# EAGLE design comms_v2 (EAGLE 9.6.2)
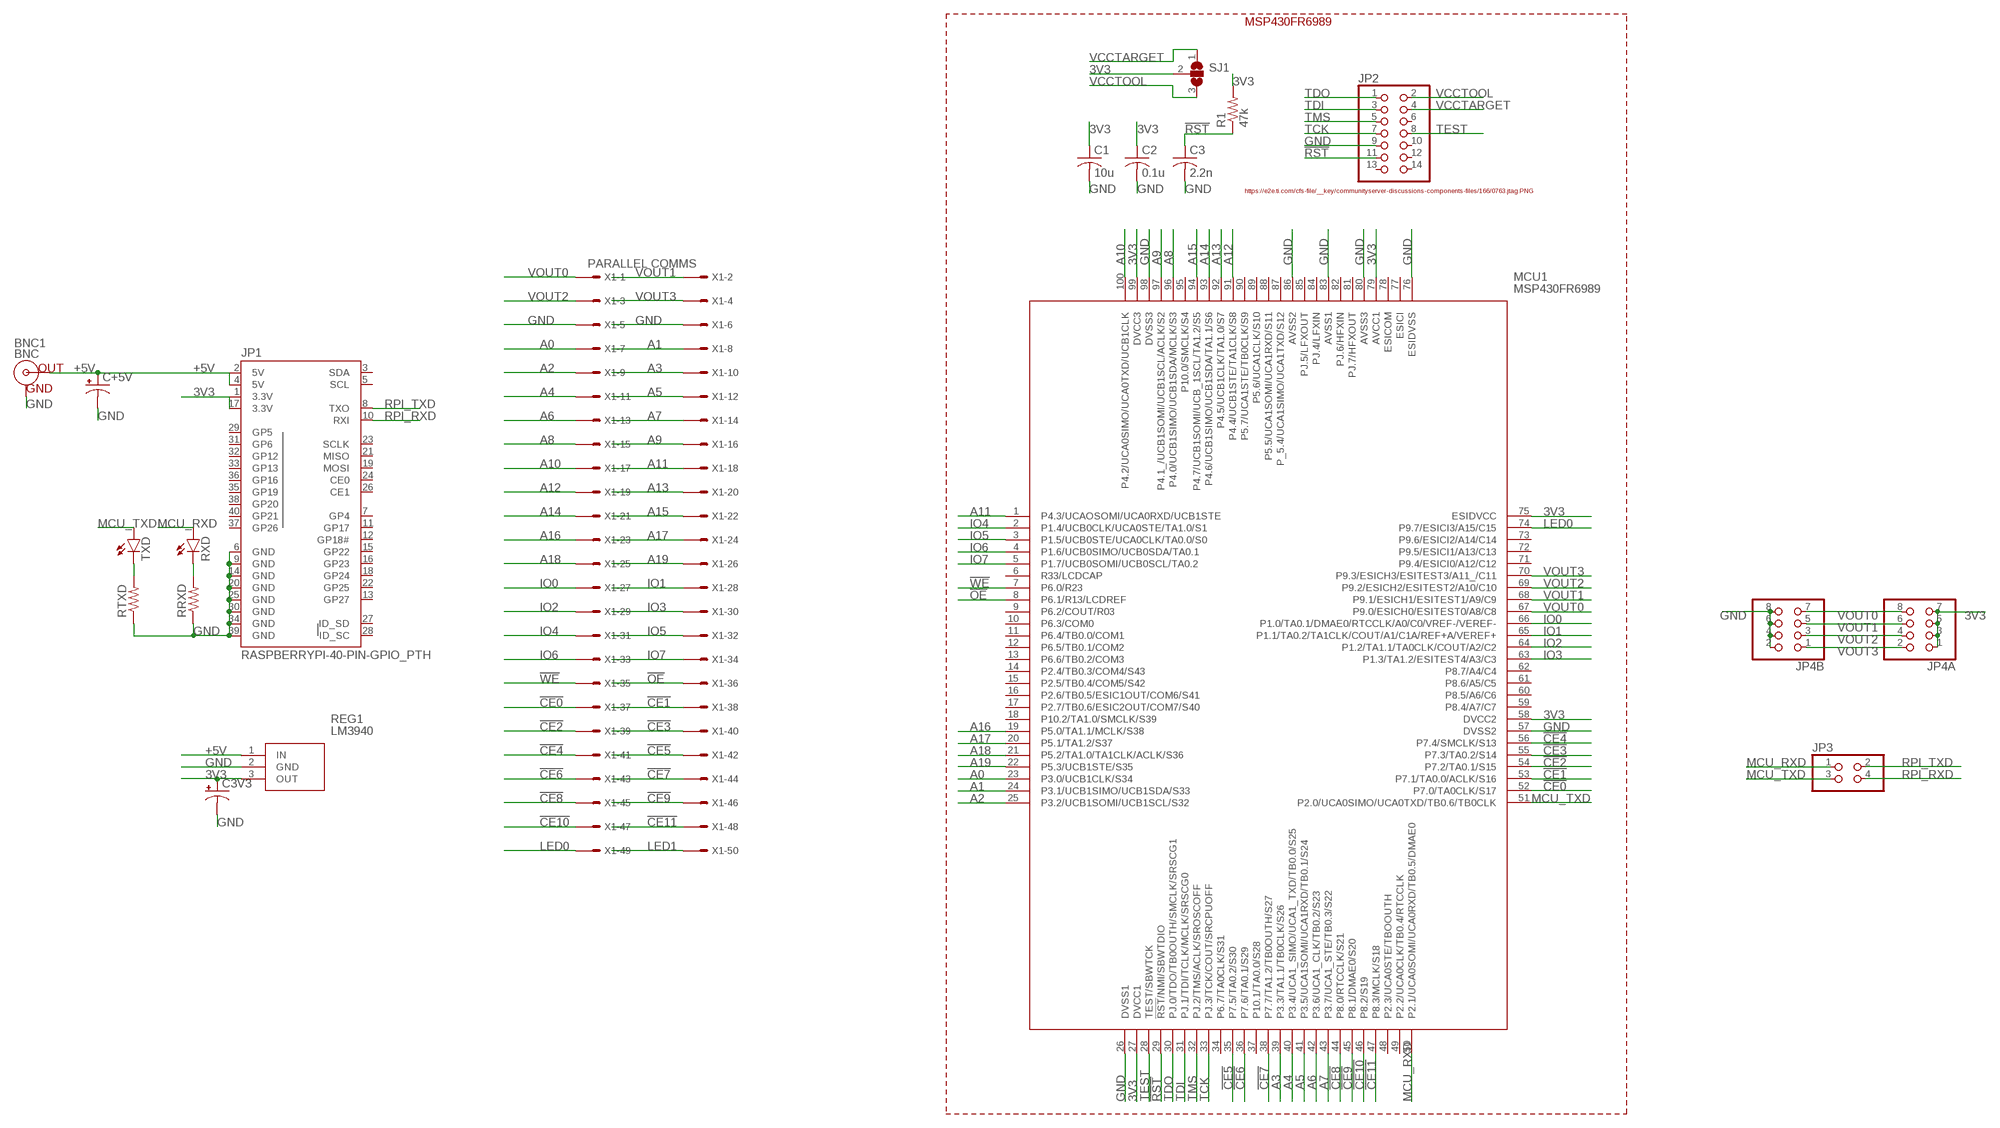
[diagram p0: schematic, sheet 1]

## Parts
BNC1  BNC  BNCPTH  [BNC]
C1  10u  C-USC0805  [C0805]
C2  0.1u  C-USC0805  [C0805]
C3  2.2n  C-USC0805  [C0805]
C3V3  CPOL-USE2.5-6  [E2,5-6]
C+5V  CPOL-USE2.5-6  [E2,5-6]
JP1  RASPBERRYPI-40-PIN-GPIO_PTH  [2X20_SHROUDED]
JP2  PINHD-2X7  [2X07]
JP3  PINHD-2X2  [2X02]
JP4A  PINHD-2X4  [2X04]
JP4B  PINHD-2X4  [2X04]
MCU1  MSP430FR6989  MSP430FR6989IPZR  [QFP50P1600X1600X160-100N]
R1  47k  R-US_R0805  [R0805]
REG1  LM3940  LM3940IT-3.3_NOPB  [TO254P470X1028X1955-3P]
RRXD  R-US_0204/7  [0204/7]
RTXD  R-US_0204/7  [0204/7]
RXD  LED3MM  [LED3MM]
SJ1  SJ2W  [SJ_2]
TXD  LED3MM  [LED3MM]
X1  PARALLEL COMMS  057-050-1  [057-050-1]

## Nets
3V3: C1.1 C2.1 C3V3.+ JP1.1(3.3V) JP1.17(3.3V) JP4A.1 JP4A.3 JP4A.5 JP4A.7 MCU1.27(DVCC1) MCU1.58(DVCC2) MCU1.75(ESIDVCC) MCU1.79(AVCC1) MCU1.99(DVCC3) R1.2 REG1.3(OUT) SJ1.2
!CE0: MCU1.52(P7.0/TA0CLK/S17) X1.37
!CE1: MCU1.53(P7.1/TA0.0/ACLK/S16) X1.38
!CE2: MCU1.54(P7.2/TA0.1/S15) X1.39
!CE3: MCU1.55(P7.3/TA0.2/S14) X1.40
!CE4: MCU1.56(P7.4/SMCLK/S13) X1.41
!CE5: MCU1.35(P7.5/TA0.2/S30) X1.42
!CE6: MCU1.36(P7.6/TA0.1/S29) X1.43
!CE7: MCU1.38(P7.7/TA1.2/TB0OUTH/S27) X1.44
!CE8: MCU1.44(P8.0/RTCCLK/S21) X1.45
!CE9: MCU1.45(P8.1/DMAE0/S20) X1.46
!CE10: MCU1.46(P8.2/S19) X1.47
!CE11: MCU1.47(P8.3/MCLK/S18) X1.48
!OE: MCU1.8(P6.1/R13/LCDREF) X1.36
!RST: C3.1 JP2.11 MCU1.29(!RST!/NMI/SBWTDIO) R1.1
!WE: MCU1.7(P6.0/R23) X1.35
+5V: BNC1.S(OUT) C+5V.+ JP1.2(5V) JP1.4(5V) REG1.1(IN)
A0: MCU1.23(P3.0/UCB1CLK/S34) X1.7
A1: MCU1.24(P3.1/UCB1SIMO/UCB1SDA/S33) X1.8
A2: MCU1.25(P3.2/UCB1SOMI/UCB1SCL/S32) X1.9
A3: MCU1.39(P3.3/TA1.1/TB0CLK/S26) X1.10
A4: MCU1.40(P3.4/UCA1_SIMO/UCA1_TXD/TB0.0/S25) X1.11
A5: MCU1.41(P3.5/UCA1SOMI/UCA1RXD/TB0.1/S24) X1.12
A6: MCU1.42(P3.6/UCA1_CLK/TB0.2/S23) X1.13
A7: MCU1.43(P3.7/UCA1_STE/TB0.3/S22) X1.14
A8: MCU1.96(P4.0/UCB1SIMO/UCB1SDA/MCLK/S3) X1.15
A9: MCU1.97(P4.1_/UCB1SOMI/UCB1SCL/ACLK/S2) X1.16
A10: MCU1.100(P4.2/UCA0SIMO/UCA0TXD/UCB1CLK) X1.17
A11: MCU1.1(P4.3/UCAOSOMI/UCA0RXD/UCB1STE) X1.18
A12: MCU1.91(P4.4/UCB1STE/TA1CLK/S8) X1.19
A13: MCU1.92(P4.5/UCB1CLK/TA1.0/S7) X1.20
A14: MCU1.93(P4.6/UCB1SIMO/UCB1SDA/TA1.1/S6) X1.21
A15: MCU1.94(P4.7/UCB1SOMI/UCB_1SCL/TA1.2/S5) X1.22
A16: MCU1.19(P5.0/TA1.1/MCLK/S38) X1.23
A17: MCU1.20(P5.1/TA1.2/S37) X1.24
A18: MCU1.21(P5.2/TA1.0/TA1CLK/ACLK/S36) X1.25
A19: MCU1.22(P5.3/UCB1STE/S35) X1.26
GND: BNC1.GND C1.2 C2.2 C3.2 C3V3.- C+5V.- JP1.6(GND) JP1.9(GND) JP1.14(GND) JP1.20(GND) JP1.25(GND) JP1.30(GND) JP1.34(GND) JP1.39(GND) JP2.9 JP4B.2 JP4B.4 JP4B.6 JP4B.8 MCU1.26(DVSS1) MCU1.57(DVSS2) MCU1.76(ESIDVSS) MCU1.80(AVSS3) MCU1.83(AVSS1) MCU1.86(AVSS2) MCU1.98(DVSS3) REG1.2(GND) RRXD.1 RTXD.1 X1.5 X1.6
IO0: MCU1.66(P1.0/TA0.1/DMAE0/RTCCLK/A0/C0/VREF-/VEREF-) X1.27
IO1: MCU1.65(P1.1/TA0.2/TA1CLK/COUT/A1/C1A/REF+A/VEREF+) X1.28
IO2: MCU1.64(P1.2/TA1.1/TA0CLK/COUT/A2/C2) X1.29
IO3: MCU1.63(P1.3/TA1.2/ESITEST4/A3/C3) X1.30
IO4: MCU1.2(P1.4/UCB0CLK/UCA0STE/TA1.0/S1) X1.31
IO5: MCU1.3(P1.5/UCB0STE/UCA0CLK/TA0.0/S0) X1.32
IO6: MCU1.4(P1.6/UCB0SIMO/UCB0SDA/TA0.1) X1.33
IO7: MCU1.5(P1.7/UCB0SOMI/UCB0SCL/TA0.2) X1.34
LED0: MCU1.74(P9.7/ESICI3/A15/C15) X1.49
LED1: X1.50
MCU_RXD: JP3.1 MCU1.50(P2.1/UCA0SOMI/UCA0RXD/TB0.5/DMAE0) RXD.A
MCU_TXD: JP3.3 MCU1.51(P2.0/UCA0SIMO/UCA0TXD/TB0.6/TB0CLK) TXD.A
N$1: RTXD.2 TXD.K(C)
N$2: RRXD.2 RXD.K(C)
RPI_RXD: JP1.10(RXI) JP3.4
RPI_TXD: JP1.8(TXO) JP3.2
TCK: JP2.7 MCU1.33(PJ.3/TCK/COUT/SRCPUOFF)
TDI: JP2.3 MCU1.31(PJ.1/TDI/TCLK/MCLK/SRSCG0)
TDO: JP2.1 MCU1.30(PJ.0/TDO/TB0OUTH/SMCLK/SRSCG1)
TEST: JP2.8 MCU1.28(TEST/SBWTCK)
TMS: JP2.5 MCU1.32(PJ.2/TMS/ACLK/SROSCOFF)
VCCTARGET: JP2.4 SJ1.1
VCCTOOL: JP2.2 SJ1.3
VOUT0: JP4A.8 JP4B.7 MCU1.67(P9.0/ESICH0/ESITEST0/A8/C8) X1.1
VOUT1: JP4A.6 JP4B.5 MCU1.68(P9.1/ESICH1/ESITEST1/A9/C9) X1.2
VOUT2: JP4A.4 JP4B.3 MCU1.69(P9.2/ESICH2/ESITEST2/A10/C10) X1.3
VOUT3: JP4A.2 JP4B.1 MCU1.70(P9.3/ESICH3/ESITEST3/A11_/C11) X1.4
Unconnected: JP1.3(SDA) JP1.5(SCL) JP1.7(GP4) JP1.11(GP17) JP1.12(GP18#) JP1.13(GP27) JP1.15(GP22) JP1.16(GP23) JP1.18(GP24) JP1.19(MOSI) JP1.21(MISO) JP1.22(GP25) JP1.23(SCLK) JP1.24(CE0) JP1.26(CE1) JP1.27(ID_SD) JP1.28(ID_SC) JP1.29(GP5) JP1.31(GP6) JP1.32(GP12) JP1.33(GP13) JP1.35(GP19) JP1.36(GP16) JP1.37(GP26) JP1.38(GP20) JP1.40(GP21) JP2.6 JP2.10 JP2.12 JP2.13 JP2.14 MCU1.6(R33/LCDCAP) MCU1.9(P6.2/COUT/R03) MCU1.10(P6.3/COM0) MCU1.11(P6.4/TB0.0/COM1) MCU1.12(P6.5/TB0.1/COM2) MCU1.13(P6.6/TB0.2/COM3) MCU1.14(P2.4/TB0.3/COM4/S43) MCU1.15(P2.5/TB0.4/COM5/S42) MCU1.16(P2.6/TB0.5/ESIC1OUT/COM6/S41) MCU1.17(P2.7/TB0.6/ESIC2OUT/COM7/S40) MCU1.18(P10.2/TA1.0/SMCLK/S39) MCU1.34(P6.7/TA0CLK/S31) MCU1.37(P10.1/TA0.0/S28) MCU1.48(P2.3/UCA0STE/TBOOUTH) MCU1.49(P2.2/UCA0CLK/TB0.4/RTCCLK) MCU1.59(P8.4/A7/C7) MCU1.60(P8.5/A6/C6) MCU1.61(P8.6/A5/C5) MCU1.62(P8.7/A4/C4) MCU1.71(P9.4/ESICI0/A12/C12) MCU1.72(P9.5/ESICI1/A13/C13) MCU1.73(P9.6/ESICI2/A14/C14) MCU1.77(ESICI) MCU1.78(ESICOM) MCU1.81(PJ.7/HFXOUT) MCU1.82(PJ.6/HFXIN) MCU1.84(PJ.4/LFXIN) MCU1.85(PJ.5/LFXOUT) MCU1.87(P_5.4/UCA1SIMO/UCA1TXD/S12) MCU1.88(P5.5/UCA1SOMI/UCA1RXD/S11) MCU1.89(P5.6/UCA1CLK/S10) MCU1.90(P5.7/UCA1STE/TB0CLK/S9) MCU1.95(P10.0/SMCLK/S4)

## Notes on the sheet
- MSP430FR6989
- https://e2e.ti.com/cfs-file/__key/communityserver-discussions-components-files/166/0763.jtag.PNG

## Library data of the parts
BNC1 = SparkFun-Connectors:BNC: BNC Right Angle Connector Mouser Part# 5227161 SparkFun Products: BNC Connector - Right Angle <https://www.sparkfun.com/products/10550>; PROD_ID: LPA-12729; SF_ID: PRT-10550
C1-C3 = rcl:C-US: CAPACITOR, American symbol; SPICEPREFIX: C
C3V3 C+5V = rcl:CPOL-US: POLARIZED CAPACITOR, American symbol; SPICEPREFIX: C
JP1 = SparkFun-Connectors:RASPBERRYPI-40-PIN-GPIO: Raspberry Pi GPIO Header 2x20 pin connector, as found on B, B+, A+ models. Both shrouded PTH and SMT versions available. SparkFun Products: GPIO Shrouded Header <https://www.sparkfun.com/products/13054>- PTH SparkFun Pi Wedge (Preassembled) <https://www.sparkfun.com/products/13717>; PROD_ID: CONN-12263; SF_ID: PRT-13054
JP2 = pinhead:PINHD-2X7: PIN HEADER
JP3 = pinhead:PINHD-2X2: PIN HEADER
JP4A JP4B = pinhead:PINHD-2X4: PIN HEADER
MCU1 = SamacSys_Parts:MSP430FR6989IPZR: MSP430FR6989 16 MHz ULP Microcontroller - 128 KB FRAM, 2KB SRAM, 83 IO, ADC12, LCD, AES, Scan IF Source: Datasheet <http://www.ti.com/lit/gpn/msp430fr6989>; ARROW_PART_NUMBER: MSP430FR6989IPZR; ARROW_PRICE-STOCK: https://www.arrow.com/en/products/msp430fr6989ipzr/texas-instruments?region=nac; DESCRIPTION: MSP430FR6989 16 MHz ULP Microcontroller - 128 KB FRAM, 2KB SRAM, 83 IO, ADC12, LCD, AES, Scan IF; HEIGHT: 1.6mm; MANUFACTURER_NAME: Texas Instruments; MANUFACTURER_PART_NUMBER: MSP430FR6989IPZR; MOUSER_PART_NUMBER: 595-MSP430FR6989IPZR; MOUSER_PRICE-STOCK: https://www.mouser.co.uk/ProductDetail/Texas-Instruments/MSP430FR6989IPZR?qs=m1T3c8F5IULmogipCvLVbA%3D%3D
R1 RRXD RTXD = rcl:R-US_: RESISTOR, American symbol; SPICEPREFIX: R
REG1 = SamacSys_Parts:LM3940IT-3.3_NOPB: 1A,3.3V,LDO Voltage Reg.,LM3940IT-3.3 Texas Instruments LM3940IT-3.3/NOPB, LDO Voltage Regulator, 1A, 3.3 V, 4.5 7.5 Vin, 3-Pin TO-220 Source: Datasheet <http://www.ti.com/general/docs/lit/getliterature.tsp?genericPartNumber=LM3940&&fileType=pdf>; ARROW_PART_NUMBER: LM3940IT-3.3/NOPB; ARROW_PRICE-STOCK: https://www.arrow.com/en/products/lm3940it-3.3nopb/texas-instruments?region=nac; DESCRIPTION: 1A,3.3V,LDO Voltage Reg.,LM3940IT-3.3 Texas Instruments LM3940IT-3.3/NOPB, LDO Voltage Regulator, 1A, 3.3 V, 4.5 7.5 Vin, 3-Pin TO-220; HEIGHT: 4.7mm; MANUFACTURER_NAME: Texas Instruments; MANUFACTURER_PART_NUMBER: LM3940IT-3.3/NOPB; MOUSER_PART_NUMBER: 926-LM3940IT-3.3NOPB; MOUSER_PRICE-STOCK: https://www.mouser.co.uk/ProductDetail/Texas-Instruments/LM3940IT-33-NOPB?qs=QbsRYf82W3FGrjqcSAbcdA%3D%3D
RXD TXD = led:LED: LED OSRAM: - CHIPLED LG R971, LG N971, LY N971, LG Q971, LY Q971, LO R971, LY R971 LH N974, LH R974 LS Q976, LO Q976, LY Q976 LO Q996 - Hyper CHIPLED LW Q18S LB Q993, LB Q99A, LB R99A - SideLED LS A670, LO A670, LY A670, LG A670, LP A670 LB A673, LV A673, LT A673, LW A673 LH A674 LY A675 LS A676, LA A676, LO A676, LY A676, LW A676 LS A679, LY A679, LG A679 - Hyper Micro SIDELED® LS Y876, LA Y876, LO Y876, LY Y876 LT Y87S - SmartLED LW L88C, LW L88S LB L89C, LB L89S, LG L890 LS L89K, LO L89K, LY L89K LS L896, LA L896, LO L896, LY L896 - TOPLED LS T670, LO T670, LY T670, LG T670, LP T670 LSG T670, LSP T670, LSY T670, LOP T670, LYG T670 LG T671, LOG T671, LSG T671 LB T673, LV T673, LT T673, LW T673 LH T674 LS T676, LA T676, LO T676, LY T676, LB T676, LH T676, LSB T676, LW T676 LB T67C, LV T67C, LT T67C, LS T67K, LO T67K, LY T67K, LW E67C LS E67B, LA E67B, LO E67B, LY E67B, LB E67C, LV E67C, LT E67C LW T67C LS T679, LY T679, LG T679 LS T770, LO T770, LY T770, LG T770, LP T770 LB T773, LV T773, LT T773, LW T773 LH T774 LS E675, LA E675, LY E675, LS T675 LS T776, LA T776, LO T776, LY T776, LB T776 LHGB T686 LT T68C, LB T68C - Hyper Mini TOPLED® LB M676 - Mini TOPLED Santana® LG M470 LS M47K, LO M47K, LY M47K Source: http://www.osram.convergy.de LUXEON: - LUMILED® LXK2-PW12-R00, LXK2-PW12-S00, LXK2-PW14-U00, LXK2-PW14-V00 LXK2-PM12-R00, LXK2-PM12-S00, LXK2-PM14-U00 LXK2-PE12-Q00, LXK2-PE12-R00, LXK2-PE12-S00, LXK2-PE14-T00, LXK2-PE14-U00 LXK2-PB12-K00, LXK2-PB12-L00, LXK2-PB12-M00, LXK2-PB14-N00, LXK2-PB14-P00, LXK2-PB14-Q00 LXK2-PR12-L00, LXK2-PR12-M00, LXK2-PR14-Q00, LXK2-PR14-R00 LXK2-PD12-Q00, LXK2-PD12-R00, LXK2-PD12-S00 LXK2-PH12-R00, LXK2-PH12-S00 LXK2-PL12-P00, LXK2-PL12-Q00, LXK2-PL12-R00 Source: www.luxeon.com KINGBRIGHT: KA-3528ASYC Source: www.kingbright.com
SJ1 = jumper:SJ2W: SMD solder JUMPER
X1 = con-panduit:057-050-: CONNECTOR 50-pin series 057 contact pc board low profile headers; OC_FARNELL: unknown; OC_NEWARK: unknown

## Net classes
2 lowpower: width 0.305 mm, drill 0.483 mm

## Board
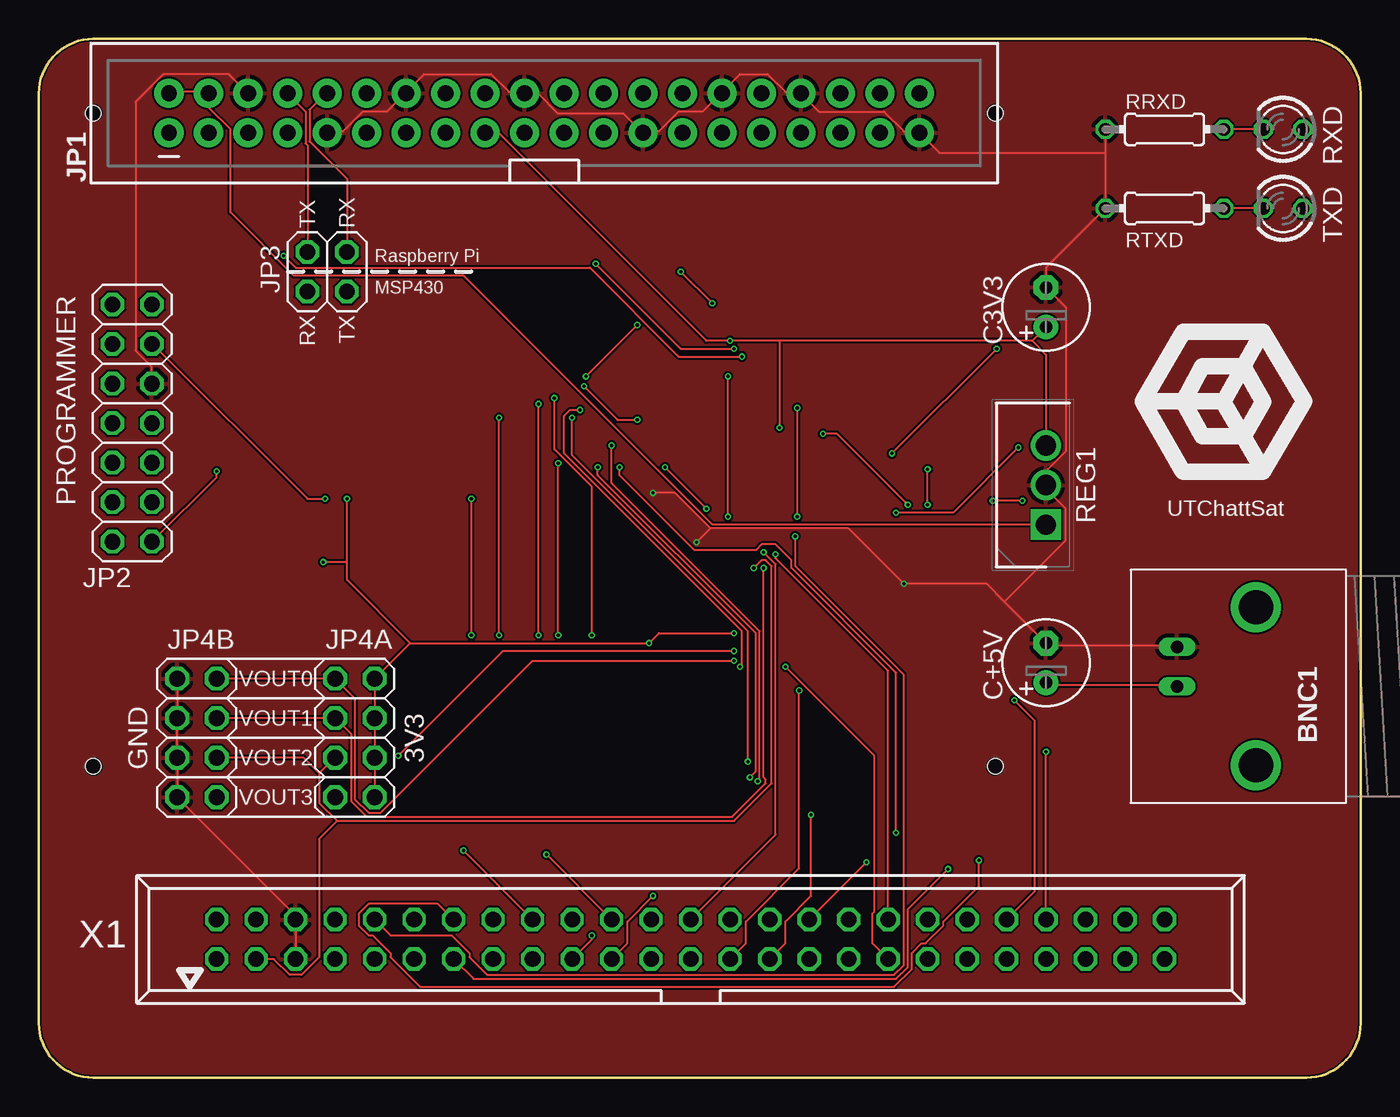
[diagram p1: board, top side]
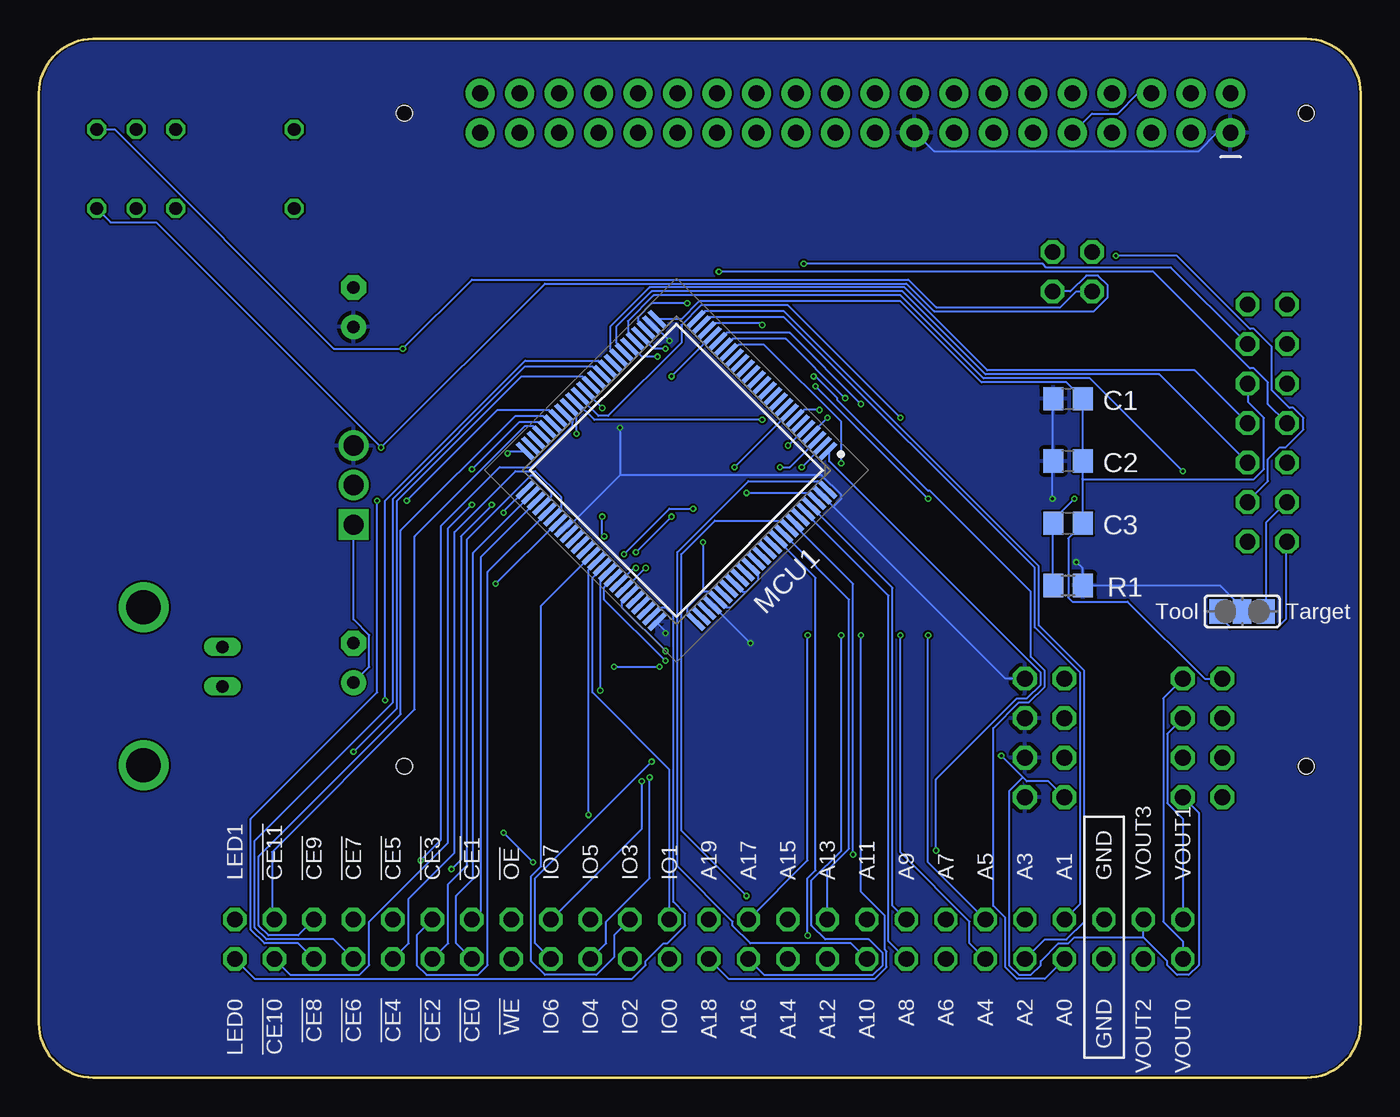
[diagram p2: board, bottom side, seen from below]

Size 85 x 66.78 mm. Coordinates in mm from the lower left corner, seen from the top.
Outline: 3.5,0 81.5,0 arc90 85,3.5 85,63.28 arc90 81.5,66.78 3.5,66.78 arc90 0,63.28 0,3.5 arc90 3.5,0
Copper layers (1*16): Top 0.035mm / dielectric 0.2mm / Bottom 0.035mm
Design rules "jlcpcb-2-layer *": minimum track width 5mil, minimum drill 0.2mm, track to track 5mil, track to pad 5mil, pad to pad 5mil, via to via 5mil, smd to smd 0mil, copper to edge 0.1mm, drill to drill 5mil, minimum pad ring 4mil, minimum via ring 4mil, stop-mask expansion 3mil, vias tented up to drill 100mil, thermal gap 10mil
Holes 1 mm at 3.5,62.01 61.5,62.01 61.5,20.01 3.5,20.01

### Footprints (pad centres in the part's own frame; a part is rotated, then mirrored left to right if it is on the bottom)
BNC = drill 2.2: 3 -5.08,5.08; 4 5.08,5.08 | drill 0.8 long: GND -2.54,0; S 0,0
C0805 = smd 1.3 x 1.5: 1 -0.95,0; 2 0.95,0
E2,5-6 = drill 0.813 pad 1.6: + -1.27,0 | drill 0.813 pad 1.6 octagon: - 1.27,0
2X20_SHROUDED = drill 1.016 pad 1.88: 1 -1.27,24.13; 2 1.27,24.13; 3 -1.27,21.59; 4 1.27,21.59; 5 -1.27,19.05; 6 1.27,19.05; 7 -1.27,16.51; 8 1.27,16.51; 9 -1.27,13.97; 10 1.27,13.97; 11 -1.27,11.43; 12 1.27,11.43; 13 -1.27,8.89; 14 1.27,8.89; 15 -1.27,6.35; 16 1.27,6.35; 17 -1.27,3.81; 18 1.27,3.81; 19 -1.27,1.27; 20 1.27,1.27; 21 -1.27,-1.27; 22 1.27,-1.27; 23 -1.27,-3.81; 24 1.27,-3.81; 25 -1.27,-6.35; 26 1.27,-6.35; 27 -1.27,-8.89; 28 1.27,-8.89; 29 -1.27,-11.43; 30 1.27,-11.43; 31 -1.27,-13.97; 32 1.27,-13.97; 33 -1.27,-16.51; 34 1.27,-16.51; 35 -1.27,-19.05; 36 1.27,-19.05; 37 -1.27,-21.59; 38 1.27,-21.59; 39 -1.27,-24.13; 40 1.27,-24.13
2X07 = drill 1.016 octagon: 1 -7.62,-1.27; 2 -7.62,1.27; 3 -5.08,-1.27; 4 -5.08,1.27; 5 -2.54,-1.27; 6 -2.54,1.27; 7 0,-1.27; 8 0,1.27; 9 2.54,-1.27; 10 2.54,1.27; 11 5.08,-1.27; 12 5.08,1.27; 13 7.62,-1.27; 14 7.62,1.27
2X02 = drill 1.016 octagon: 1 -1.27,-1.27; 2 -1.27,1.27; 3 1.27,-1.27; 4 1.27,1.27
2X04 = drill 1.016 octagon: 1 -3.81,-1.27; 2 -3.81,1.27; 3 -1.27,-1.27; 4 -1.27,1.27; 5 1.27,-1.27; 6 1.27,1.27; 7 3.81,-1.27; 8 3.81,1.27
QFP50P1600X1600X160-100N = smd 1.475 x 0.3: 1 -7.738,6; 2 -7.738,5.5; 3 -7.738,5; 4 -7.738,4.5; 5 -7.738,4; 6 -7.738,3.5; 7 -7.738,3; 8 -7.738,2.5; 9 -7.738,2; 10 -7.738,1.5; 11 -7.738,1; 12 -7.738,0.5; 13 -7.738,0; 14 -7.738,-0.5; 15 -7.738,-1; 16 -7.738,-1.5; 17 -7.738,-2; 18 -7.738,-2.5; 19 -7.738,-3; 20 -7.738,-3.5; 21 -7.738,-4; 22 -7.738,-4.5; 23 -7.738,-5; 24 -7.738,-5.5; 25 -7.738,-6; 51 7.738,-6; 52 7.738,-5.5; 53 7.738,-5; 54 7.738,-4.5; 55 7.738,-4; 56 7.738,-3.5; 57 7.738,-3; 58 7.738,-2.5; 59 7.738,-2; 60 7.738,-1.5; 61 7.738,-1; 62 7.738,-0.5; 63 7.738,0; 64 7.738,0.5; 65 7.738,1; 66 7.738,1.5; 67 7.738,2; 68 7.738,2.5; 69 7.738,3; 70 7.738,3.5; 71 7.738,4; 72 7.738,4.5; 73 7.738,5; 74 7.738,5.5; 75 7.738,6 | smd 0.3 x 1.475: 26 -6,-7.738; 27 -5.5,-7.738; 28 -5,-7.738; 29 -4.5,-7.738; 30 -4,-7.738; 31 -3.5,-7.738; 32 -3,-7.738; 33 -2.5,-7.738; 34 -2,-7.738; 35 -1.5,-7.738; 36 -1,-7.738; 37 -0.5,-7.738; 38 0,-7.738; 39 0.5,-7.738; 40 1,-7.738; 41 1.5,-7.738; 42 2,-7.738; 43 2.5,-7.738; 44 3,-7.738; 45 3.5,-7.738; 46 4,-7.738; 47 4.5,-7.738; 48 5,-7.738; 49 5.5,-7.738; 50 6,-7.738; 76 6,7.738; 77 5.5,7.738; 78 5,7.738; 79 4.5,7.738; 80 4,7.738; 81 3.5,7.738; 82 3,7.738; 83 2.5,7.738; 84 2,7.738; 85 1.5,7.738; 86 1,7.738; 87 0.5,7.738; 88 0,7.738; 89 -0.5,7.738; 90 -1,7.738; 91 -1.5,7.738; 92 -2,7.738; 93 -2.5,7.738; 94 -3,7.738; 95 -3.5,7.738; 96 -4,7.738; 97 -4.5,7.738; 98 -5,7.738; 99 -5.5,7.738; 100 -6,7.738
R0805 = smd 1.3 x 1.5: 1 -0.95,0; 2 0.95,0
TO254P470X1028X1955-3P = drill 1.29 pad 1.935 square: 1 0,0 | drill 1.29 pad 1.935: 2 2.54,0; 3 5.08,0
0204/7 = drill 0.813 octagon: 1 -3.81,0; 2 3.81,0
LED3MM = drill 0.813 octagon: A -1.27,0; K 1.27,0
SJ_2 = smd 1.168 x 1.6: 1 -1.524,0; 2 0,0; 3 1.524,0
057-050-1 = drill 1 octagon: 1 -30.48,-1.27; 2 -30.48,1.27; 3 -27.94,-1.27; 4 -27.94,1.27; 5 -25.4,-1.27; 6 -25.4,1.27; 7 -22.86,-1.27; 8 -22.86,1.27; 9 -20.32,-1.27; 10 -20.32,1.27; 11 -17.78,-1.27; 12 -17.78,1.27; 13 -15.24,-1.27; 14 -15.24,1.27; 15 -12.7,-1.27; 16 -12.7,1.27; 17 -10.16,-1.27; 18 -10.16,1.27; 19 -7.62,-1.27; 20 -7.62,1.27; 21 -5.08,-1.27; 22 -5.08,1.27; 23 -2.54,-1.27; 24 -2.54,1.27; 25 0,-1.27; 26 0,1.27; 27 2.54,-1.27; 28 2.54,1.27; 29 5.08,-1.27; 30 5.08,1.27; 31 7.62,-1.27; 32 7.62,1.27; 33 10.16,-1.27; 34 10.16,1.27; 35 12.7,-1.27; 36 12.7,1.27; 37 15.24,-1.27; 38 15.24,1.27; 39 17.78,-1.27; 40 17.78,1.27; 41 20.32,-1.27; 42 20.32,1.27; 43 22.86,-1.27; 44 22.86,1.27; 45 25.4,-1.27; 46 25.4,1.27; 47 27.94,-1.27; 48 27.94,1.27; 49 30.48,-1.27; 50 30.48,1.27

### Placement (x,y rotation side)
BNC1  73.19,25.16 270 top
C1  18.82,43.64 0 bottom
C2  18.82,39.64 0 bottom
C3  18.82,35.64 0 bottom
C3V3  64.77,49.53 90 top
C+5V  64.77,26.67 90 top
JP1  32.5,62.01 90 top
JP2  6,42.08 90 top
JP3  18.54,51.82 0 top
JP4A  20.32,21.84 90 top
JP4B  10.16,21.84 90 top
MCU1  44,39.04 225 bottom
R1  18.82,31.64 0 bottom
REG1  64.77,35.56 90 top
RRXD  72.39,60.96 0 top
RTXD  72.39,55.88 0 top
RXD  80.01,60.96 180 top
SJ1  7.62,29.97 180 bottom
TXD  80.01,55.88 180 top
X1  41.91,8.89 0 top

### Tracks (layer width: path | path; a pad name or v marks a point on that pad's centre or on a via)
3V3  (via drill 0.2)
  Top 0.127: JP4A.1 JP4A.3 JP4A.5 JP4A.7 23.88,27.94 | 23.88,27.94 v39.24,27.94 39.88,28.57 v44.7,28.57 | 19.81,33.15 19.81,32 23.88,27.94 | 19.81,33.15 v19.81,37.21 | 19.81,33.15 v18.29,33.15 | 63.88,47.37 47.62,47.37 | 47.62,47.37 v44.45,47.37 42.93,47.37 29.59,60.71 28.7,60.71 JP1.17 | C3V3.+ 63.88,47.37 | REG1.3 64.77,46.48 63.88,47.37 | 47.62,47.37 v47.62,41.78
  Bottom 0.127: SJ1.2 7.62,30.23 9.02,31.62 17.78,31.62 R1.2 17.91,31.75 17.91,32.77 v18.29,33.15 | C1.1 19.81,43.56 19.81,39.75 C2.1 19.81,39.62 v19.81,37.21 | v39.24,27.94 41.66,30.35 MCU1.79 | v44.7,28.57 44.7,28.7 45.21,29.21 MCU1.75 | 33.91,36.7 22.86,25.65 JP4A.7 | 33.91,36.7 34.54,37.34 MCU1.99 | 47.62,38.73 50.93,35.43 51.18,35.43 MCU1.58 | 47.62,38.73 34.67,38.73 33.4,37.47 33.4,37.21 33.91,36.7 | JP1.1 8.38,60.71 9.27,60.71 10.41,59.56 27.43,59.56 28.57,60.71 JP1.17 | v44.45,47.37 45.47,48.39 MCU1.27 | v47.62,41.78 47.62,38.73
  pour Bottom: 0,67.31 85.09,67.31 85.09,0 0,0
!CE0
  Bottom 0.127: X1.37 58.17,8.64 58.17,11.68 57.07,12.78 57.07,33.73 53.47,37.34 MCU1.52
!CE1
  Bottom 0.127: X1.38 56.59,10.72 56.59,33.45 53.09,36.96 53.09,37.08 MCU1.53
!CE2
  Bottom 0.127: X1.39 58.67,8.64 58.67,12.45 57.45,13.66 57.45,34.62 53.34,38.73 53.21,38.73 52.07,37.59 52.07,37.34 52.58,36.83 MCU1.54
!CE3
  Bottom 0.127: X1.40 60.71,9.14 60.71,7.24 60.07,6.6 56.77,6.6 56.13,7.24 56.13,32.51 52.32,36.32 MCU1.55
!CE4
  Bottom 0.127: X1.41 61.21,8.64 61.21,11.51 58.27,14.45 58.27,35.08 54.36,38.99 53.09,38.99 51.44,37.34 51.44,36.58 51.94,36.07 MCU1.56
!CE5  (via drill 0.2)
  Top 0.127: v62.74,24.26 64.01,22.99 64.01,11.94 X1.42
  Bottom 0.127: v62.74,24.26 62.74,37.08 53.72,46.1 49.02,46.1 48.51,45.59 MCU1.35
!CE6
  Bottom 0.127: X1.43 66.04,8.89 70.36,8.89 71.12,9.65 71.12,15.24 62.23,24.13 62.23,37.21 53.72,45.72 49.4,45.72 49.02,45.34 48.77,45.34 MCU1.36
!CE7  (via drill 0.2)
  Top 0.127: X1.44 v64.77,20.95
  Bottom 0.127: v64.77,20.95 61.98,23.75 61.98,37.08 53.98,45.09 50.04,45.09 49.53,44.58 MCU1.38
!CE8  (via drill 0.2)
  Top 0.127: v63.25,37.08 v61.34,37.08
  Bottom 0.127: v61.34,37.08 55.5,42.93 52.2,42.93 51.69,42.42 MCU1.44 | v63.25,37.08 63.25,24.77 71.37,16.64 71.37,9.53 70.48,8.64 68.33,8.64 X1.45
!CE9
  Bottom 0.127: X1.46 68.33,9.14 70.23,9.14 70.87,9.78 70.87,14.22 61.72,23.37 61.72,35.18 54.36,42.55 52.58,42.55 52.07,42.04 MCU1.45
!CE10  (via drill 0.2)
  Top 0.127: v57.15,36.83 v57.15,39.12
  Bottom 0.127: v57.15,39.12 54.1,42.16 52.83,42.16 52.69,42.02 52.7,42.09 MCU1.46 | v57.15,36.83 57.17,36.83 58.7,35.31 58.7,15.09 63.75,10.03 63.75,7.24 64.39,6.6 68.83,6.6 X1.47
!CE11
  Bottom 0.127: X1.48 70,10.31 70,14.5 60.83,23.67 60.83,34.8 53.72,41.91 53.21,41.91 52.7,41.4 MCU1.47
!OE  (via drill 0.2)
  Top 0.127: v42.93,36.58 v40.26,39.24 | v47.37,33.66 47.37,33.4 54.61,26.16 X1.36
  Bottom 0.127: v40.26,39.24 36.83,42.67 MCU1.8 | v42.93,36.58 44.45,36.58 v47.37,33.66
!RST  (via drill 0.2)
  Top 0.127: v44.7,46.86 41.27,46.86 v35.81,52.32 | v18.41,37.21 17.27,37.21 7.37,47.12 JP2.11
  Bottom 0.127: R1.1 19.81,31.75 19.81,35.56 C3.1 19.68,35.69 19.68,35.94 v18.41,37.21 | v44.7,46.86 45.47,46.86 46.23,47.62 MCU1.29 | v35.81,52.32 20.45,52.32 20.19,52.07 12.19,52.07 7.37,47.24 JP2.11
!WE  (via drill 0.2)
  Top 0.127: v34.8,42.93 34.16,42.93 33.78,42.55 33.78,40.13 45.21,28.7 45.21,26.54 v45.09,26.42 | v48.01,26.42 53.72,20.7 53.72,10.67 53.59,10.54 53.59,8.64 X1.35
  Bottom 0.127: v34.8,42.93 35.81,42.93 36.32,42.42 MCU1.7 | v48.01,26.42 v45.09,26.42
+5V
  Top 0.127: JP1.2 8.38,63.37 10.79,63.37 JP1.4 10.92,63.25 10.92,62.36 12.32,60.96 12.32,55.63 16.38,51.56 27.3,51.56 43.31,35.56 REG1.1 | C+5V.+ 64.9,25.27 73.15,25.27 BNC1.S
  Bottom 0.127: REG1.1 64.77,29.46 63.75,28.45 63.75,26.42 C+5V.+
A0  (via drill 0.2)
  Top 0.127: v35.18,45.09 v38.48,48.39
  Bottom 0.127: 42.04,48.13 41.99,48.13 41.88,48.23 41.6,48.51 38.61,48.51 v38.48,48.39 | v35.18,45.09 35.05,45.09 33.66,43.69 33.66,43.56 27.81,37.72 27.69,37.72 21.21,31.24 21.21,27.05 20.32,26.16 20.32,25.15 21.34,24.13 21.97,24.13 23.62,22.48 23.62,11.05 22.86,10.29 22.86,7.11 22.1,6.35 20.32,6.35 X1.7
  Bottom 0.152: MCU1.23 41.88,48.23
A1
  Bottom 0.127: X1.8 18.03,11.18 18.03,26.04 20.95,28.96 20.95,32.77 37.08,48.9 41.91,48.9 42.29,48.51 MCU1.24
A2
  Bottom 0.127: X1.9 20.32,8.89 18.92,8.89 17.78,10.03 17.78,26.16 20.7,29.08 20.7,32.89 37.08,49.28 42.16,49.28 42.67,48.77 MCU1.25
A3  (via drill 0.2)
  Top 0.127: v48.77,36.07 v48.77,43.05 | v48.64,34.8 48.64,32.89 55.63,25.91 55.63,7.24 54.99,6.6 28.83,6.6 27.69,7.75 27.69,8 26.54,9.14 22.61,9.14 X1.10
  Bottom 0.127: v48.77,43.05 49.78,44.07 MCU1.39 | v48.77,36.07 48.77,34.92 v48.64,34.8
A4  (via drill 0.2)
  Top 0.127: v29.59,28.45 v29.59,42.42
  Bottom 0.127: v29.59,42.42 36.83,49.66 42.42,49.66 43.69,48.39 43.69,47.24 48.39,42.55 49.02,42.55 50.16,43.69 MCU1.40 | v29.59,28.45 29.59,14.48 25.15,10.03 25.15,8.64 X1.11
A5  (via drill 0.2)
  Top 0.127: v38.48,42.29 37.21,42.29 v35.05,44.45 | v27.81,28.45 v27.81,37.21
  Bottom 0.127: v38.48,42.29 49.28,42.29 50.42,43.43 MCU1.41 | v27.81,37.21 v35.05,44.45 | v27.81,28.45 27.81,13.84 X1.12
A6  (via drill 0.2)
  Top 0.127: v50.42,41.4 51.31,41.4 v55.88,36.83 | v58.47,13.41 55.88,10.82 55.88,7.11 55.12,6.35 27.94,6.35 X1.13
  Bottom 0.127: v50.42,41.4 50.42,42.62 50.8,43 50.8,43.05 MCU1.42 | v55.88,36.83 55.88,36.78 57.86,34.8 57.86,14.02 v58.47,13.41
A7  (via drill 0.2)
  Top 0.127: v60.45,13.97 60.45,12.32 58.17,10.03 58.17,9.78 57.02,8.64 56.77,8.64 56.13,8 56.13,6.99 54.99,5.84 24.51,5.84 22.61,7.75 22.61,8 21.46,9.14 21.21,9.14 20.57,9.78 20.57,10.54 21.21,11.18 25.65,11.18 X1.14
  Bottom 0.127: v60.45,13.97 59.16,15.27 59.16,35.46 55.37,39.24 53.34,39.24 50.67,41.91 50.67,42.16 51.18,42.67 MCU1.43
A8
  Bottom 0.127: X1.15 30.35,8.76 30.35,30.99 35.69,36.32 MCU1.96
A9
  Bottom 0.127: X1.16 30.1,11.05 30.1,31.5 35.31,36.7 MCU1.97
A10
  Bottom 0.127: X1.17 32.77,8.64 39.24,8.64 40.39,9.78 40.39,10.03 43.94,13.59 43.94,33.78 39.37,38.35 34.9,38.35 34.39,37.85 34.29,37.85 MCU1.100
A11  (via drill 0.2)
  Top 0.127: X1.18 v27.3,14.61
  Bottom 0.127: v27.3,14.61 27.3,19.18 22.1,24.38 21.46,24.38 20.57,25.27 20.57,26.04 34.16,39.62 34.16,40.26 MCU1.1
A12  (via drill 0.2)
  Top 0.127: v35.56,9.14 35.56,8.89 X1.19
  Bottom 0.127: v35.56,9.14 35.56,12.83 35.05,13.34 35.05,32.13 37.47,34.54 MCU1.91
A13
  Bottom 0.127: X1.20 34.29,13.34 32.89,14.73 32.89,30.73 37.08,34.92 MCU1.92
A14  (via drill 0.2)
  Top 0.127: v39.5,11.68 37.85,10.03 37.85,8.64 X1.21
  Bottom 0.127: v39.5,11.68 43.69,15.88 43.69,33.66 41.53,35.81 37.21,35.81 36.83,35.43 MCU1.93
A15  (via drill 0.2)
  Top 0.127: X1.22 v32.64,14.35
  Bottom 0.127: v32.64,14.35 32.64,31.75 36.32,35.43 36.32,35.69 MCU1.94
A16  (via drill 0.2)
  Top 0.127: v33.4,28.45 v33.4,39.5
  Bottom 0.127: v33.4,39.5 33.4,42.16 38.35,47.12 40.01,47.12 40.39,46.74 40.64,46.74 MCU1.19 | v33.4,28.45 33.4,14.61 35.31,12.7 35.31,9.78 34.42,8.89 31.62,8.89 30.73,8 30.73,7.24 31.37,6.6 38.35,6.6 X1.23
A17  (via drill 0.2)
  Top 0.127: v33.15,43.69 33.15,40.39 35.56,37.97 v35.56,28.45
  Bottom 0.127: v33.15,43.69 36.96,47.5 40.39,47.5 40.89,46.99 MCU1.20 | v35.56,28.45 35.56,13.97 X1.24
A18  (via drill 0.2)
  Top 0.127: v32.13,28.45 v32.13,43.31
  Bottom 0.127: v32.13,43.31 36.7,47.88 40.77,47.88 41.27,47.37 MCU1.21 | v32.13,28.45 32.13,11.94 30.61,10.41 30.61,8.26 30.48,8.13 30.48,7.11 31.24,6.35 40.64,6.35 X1.25
A19  (via drill 0.2)
  Top 0.127: v44.32,36.07 v44.32,45.09 | v46.61,33.78 47.37,33.02 47.37,15.62 X1.26
  Bottom 0.127: v44.32,45.09 41.78,47.62 MCU1.22 | v46.61,33.78 v44.32,36.07
GND  (via drill 0.2)
  Top 0.127: JP4B.8 JP4B.6 JP4B.4 JP4B.2 16.51,10.41 X1.6 X1.5 | 62.1,30.61 C+5V.- 64.9,27.81 73.15,27.81 BNC1.GND | 62.1,30.61 60.96,31.75 v55.63,31.75 52.07,35.31 43.18,35.31 | v39.5,37.59 40.89,37.59 43.18,35.31 | 43.18,35.31 v42.29,34.42 | 62.1,30.61 66.04,34.54 66.04,36.58 64.77,37.85 REG1.2 64.77,38.99 66.04,40.26 66.04,49.53 C3V3.- 64.77,52.07 RTXD.1 68.58,59.44 | JP1.9 18.54,60.83 19.56,60.83 20.83,62.1 22.35,62.1 23.5,63.25 JP1.14 23.62,63.37 24.77,64.52 29.08,64.52 30.23,63.37 31.11,63.37 JP1.20 31.24,63.25 32.13,63.25 33.4,61.98 37.59,61.98 38.73,60.83 JP1.25 38.86,60.83 39.88,60.83 41.15,62.1 42.67,62.1 43.81,63.25 JP1.30 43.94,63.37 45.09,64.52 46.86,64.52 48.01,63.37 48.9,63.37 JP1.34 49.02,63.25 50.16,62.1 54.36,62.1 55.63,60.83 56.52,60.83 JP1.39 57.9,59.47 68.58,59.47 RRXD.1 | JP2.9 7.24,44.7 7.24,45.72 6.22,46.74 6.22,62.74 8,64.52 12.19,64.52 13.34,63.37 JP1.6
  Bottom 0.127: 17.91,38.48 17.91,39.62 C2.2 17.91,39.75 17.91,43.56 C1.2 17.91,43.69 18.92,44.7 24.38,44.7 29.59,49.91 42.55,49.91 43.69,48.77 45.21,48.77 MCU1.26 | 17.91,38.48 17.91,35.69 C3.2 17.91,35.56 18.8,34.67 18.8,30.86 18.54,30.61 14.99,30.61 10.03,25.65 JP4B.8 | 17.91,38.48 6.86,38.48 6.22,39.12 6.22,42.42 7.24,43.43 7.24,44.58 JP2.9 | 39.5,31.24 38.73,32 38.73,32.38 39.12,32.77 MCU1.86 | 39.5,31.24 39.75,31.24 40.26,31.75 MCU1.83 | 39.5,31.24 40.51,30.23 40.77,30.23 41.27,30.73 MCU1.80 41.4,30.86 41.78,31.24 42.29,31.24 | 42.29,31.24 43.31,30.23 43.31,29.84 42.8,29.34 MCU1.76 | v55.63,31.75 51.69,35.69 MCU1.57 | MCU1.98 34.99,37.18 35.41,37.59 v39.5,37.59 | v42.29,34.42 42.29,31.24 | JP1.6 13.46,63.25 14.35,63.25 15.62,61.98 17.27,61.98 18.41,60.83 JP1.9
  pour Top: 0,67.31 0,0 85.09,0 85.09,67.31
IO0  (via drill 0.2)
  Top 0.127: v48.9,24.89 48.9,13.46 45.47,10.03 45.47,8.64 X1.27
  Bottom 0.127: v48.9,24.89 48.9,32 48.51,32.38 MCU1.66
IO1
  Bottom 0.127: X1.28 44.45,19.81 49.4,24.77 49.4,32.13 48.77,32.77 MCU1.65
IO2  (via drill 0.2)
  Top 0.127: v49.66,16.89 49.66,11.68 48.01,10.03 48.01,8.64 X1.29
  Bottom 0.127: v49.66,16.89 49.66,32.64 49.15,33.15 MCU1.64
IO3
  Bottom 0.127: X1.30 48.01,9.14 48.01,7.75 49.15,6.6 52.45,6.6 53.34,7.49 53.34,12.95 52.7,13.59 52.7,30.35 49.53,33.53 MCU1.63
IO4  (via drill 0.2)
  Top 0.127: v35.94,39.24 35.94,38.73 46.1,28.57 46.1,19.68 v45.72,19.3
  Bottom 0.127: v35.94,39.24 34.67,40.51 MCU1.2 | v45.72,19.3 45.72,12.83 48.51,10.03 48.51,8.64 X1.31
IO5  (via drill 0.2)
  Top 0.127: v37.34,39.24 37.34,38.73 42.16,33.91 46.1,33.91 46.48,34.29 47.37,34.29 48.39,33.27 48.39,32.77 55.12,26.04 v55.12,15.75 | X1.32 v53.21,13.84
  Bottom 0.127: v37.34,39.24 36.7,39.24 35.05,40.89 MCU1.3 | v53.21,13.84 v55.12,15.75
IO6  (via drill 0.2)
  Top 0.127: v34.29,42.42 34.29,40.01 45.59,28.7 v45.59,20.32
  Bottom 0.127: v34.29,42.42 35.31,41.4 MCU1.4 | v45.59,20.32 53.09,12.83 53.09,8.64 X1.33
IO7  (via drill 0.2)
  Top 0.127: v36.83,40.64 36.83,38.23 46.35,28.7 46.35,19.18 v46.23,19.05
  Bottom 0.127: v36.83,40.64 35.81,41.66 MCU1.5 | v46.23,19.05 46.23,16 X1.34
LED0
  Bottom 0.127: X1.49 71.12,6.35 46.86,6.35 45.97,7.24 45.97,7.49 44.83,8.64 44.58,8.64 43.43,9.78 43.43,10.54 44.2,11.3 44.2,29.72 44.7,30.23 44.96,30.23 45.47,29.72 MCU1.74
MCU_RXD  (via drill 0.2)
  Top 0.127: v61.59,46.86 v54.86,40.13
  Bottom 0.127: v54.86,40.13 54.74,40.26 MCU1.50 | RXD.A 80.14,60.96 66.04,46.86 v61.59,46.86 57.15,51.31 29.08,51.31 27.3,49.53 19.3,49.53 18.29,50.55 JP3.1
MCU_TXD  (via drill 0.2)
  Top 0.127: v55.12,36.32 58.8,36.32 v62.99,40.51
  Bottom 0.127: TXD.A 80.39,54.99 77.47,54.99 v62.99,40.51 52.45,51.05 29.21,51.05 27.43,49.28 17.14,49.28 16.26,50.16 16.26,50.93 16.89,51.56 17.65,51.56 18.67,50.55 JP3.3 | v55.12,36.32 55.12,36.41 MCU1.51
N$1
  Top 0.127: TXD.K RTXD.2
N$2
  Top 0.127: RXD.K RRXD.2
RPI_RXD
  Top 0.127: JP3.4 19.81,57.78 17.4,60.2 17.4,62.23 18.41,63.25 JP1.10
RPI_TXD
  Top 0.127: JP3.2 17.27,59.94 17.14,60.07 17.14,62.1 16,63.25 JP1.8
TCK
  Bottom 0.127: MCU1.33 47.75,46.35 48.26,46.86 48.26,48.26 45.72,50.8 29.34,50.8 24,45.47 10.67,45.47 7.37,42.16 JP2.7
TDI  (via drill 0.2)
  Top 0.127: v45.21,46.35 41.15,46.35 35.43,52.07 16.51,52.07 v15.75,52.83
  Bottom 0.127: v45.21,46.35 46.23,46.35 46.74,46.86 46.99,46.86 MCU1.31 | v15.75,52.83 11.81,52.83 7.11,48.13 6.86,48.13 5.71,46.99 5.71,44.2 4.57,43.05 4.32,43.05 3.68,42.42 3.68,41.66 4.83,40.51 5.21,40.51 5.97,39.75 5.97,38.35 7.24,37.08 JP2.3
TDO  (via drill 0.2)
  Top 0.127: v11.43,38.99 11.43,38.61 7.37,34.54 JP2.1
  Bottom 0.127: v11.43,38.99 17.4,44.96 24.26,44.96 29.59,50.29 45.47,50.29 47.12,48.64 47.12,47.75 46.74,47.37 MCU1.30
TEST  (via drill 0.2)
  Top 0.127: v41.27,51.82 v43.31,49.78
  Bottom 0.127: v43.31,49.78 45.59,49.78 46.48,48.9 46.48,48.64 45.97,48.13 MCU1.28 | v41.27,51.82 13.34,51.82 7.11,45.59 6.86,45.59 5.97,44.7 5.97,43.31 4.83,42.16 JP2.8
TMS
  Bottom 0.127: MCU1.32 47.37,46.74 47.88,47.24 47.88,48.26 45.59,50.55 29.46,50.55 24.13,45.21 12.95,45.21 7.37,39.62 JP2.5
VCCTARGET
  Bottom 0.127: SJ1.1 6.1,35.69 4.83,36.96 JP2.4
VCCTOOL
  Bottom 0.127: SJ1.3 9.14,29.72 8.38,28.96 5.33,28.96 4.83,29.46 4.83,34.42 JP2.2
VOUT0  (via drill 0.2)
  Top 0.127: v44.7,26.8 31.75,26.8 21.97,17.02 21.21,17.02 20.32,17.91 20.32,24.38 JP4A.8 JP4B.7
  Bottom 0.127: X1.1 11.43,8.76 12.7,10.03 12.7,24.38 JP4B.7 | v44.7,26.8 48.64,30.73 48.64,31.52 48.13,32.03 48.13,32.13 MCU1.67
VOUT1  (via drill 0.2)
  Top 0.127: v46.61,32.77 46.61,19.3 46.74,19.18 46.74,18.92 44.58,16.76 21.08,16.76 20.07,17.78 20.07,22.1 JP4A.6 JP4B.5
  Bottom 0.127: X1.2 11.43,16.64 12.45,17.65 12.45,22.1 JP4B.5 | v46.61,32.77 46.74,32.77 47.62,31.88 MCU1.68
VOUT2  (via drill 0.2)
  Top 0.127: v45.97,32.77 46.48,33.27 46.74,33.27 47.12,32.89 47.12,18.92 44.7,16.51 19.18,16.51 | 19.18,16.51 18.03,17.65 18.03,19.56 | JP4A.4 18.03,19.56 | X1.3 15.11,7.62 16.13,6.6 16.89,6.6 18.03,7.75 18.03,15.37 19.18,16.51 | JP4B.3 17.02,20.57 18.03,19.56
  Bottom 0.127: v45.97,32.77 47.24,31.5 MCU1.69
VOUT3  (via drill 0.2)
  Top 0.127: v44.7,27.43 29.84,27.43 v23.11,20.7
  Bottom 0.127: 13.97,9.02 X1.4 | 13.97,9.02 12.45,7.49 12.45,7.24 11.81,6.6 11.05,6.6 10.41,7.24 10.41,17.02 JP4B.1 | v44.7,27.43 47.5,30.23 47.5,30.61 47.12,30.99 MCU1.70 | 21.72,19.3 21.46,19.05 20.07,19.05 JP4A.2 | 21.72,19.3 v23.11,20.7 | 13.97,9.02 18.41,9.02 18.8,8.64 19.43,8.64 20.57,7.49 20.57,7.24 21.21,6.6 21.97,6.6 22.61,7.24 22.61,18.41 21.72,19.3

### Text on the board
tPlace: TX | RX | Raspberry Pi | MSP430 | PROGRAMMER | RX | TX | VOUT0 | VOUT1 | GND | 3V3 | VOUT2 | VOUT3
bPlace: Target | Tool | VOUT1 | VOUT3 | GND | A1 | A3 | A5 | A7 | A9 | A11 | A13 | A15 | A17 | A19 | IO1 | IO3 | IO5 | IO7 | !OE | !CE1 | !CE3 | !CE5 | !CE7 | !CE9 | !CE11 | LED1 | VOUT0 | VOUT2 | GND | A0 | A2 | A4 | A6 | A8 | A10 | A12 | A14 | A16 | A18 | IO0 | IO2 | IO4 | IO6 | !WE | !CE0 | !CE2 | !CE4 | !CE6 | !CE8 | !CE10 | LED0
tNames: UTChattSat